# Altium schematic sheet 0002_Page 2.SchDoc
size 553 x 429 mm
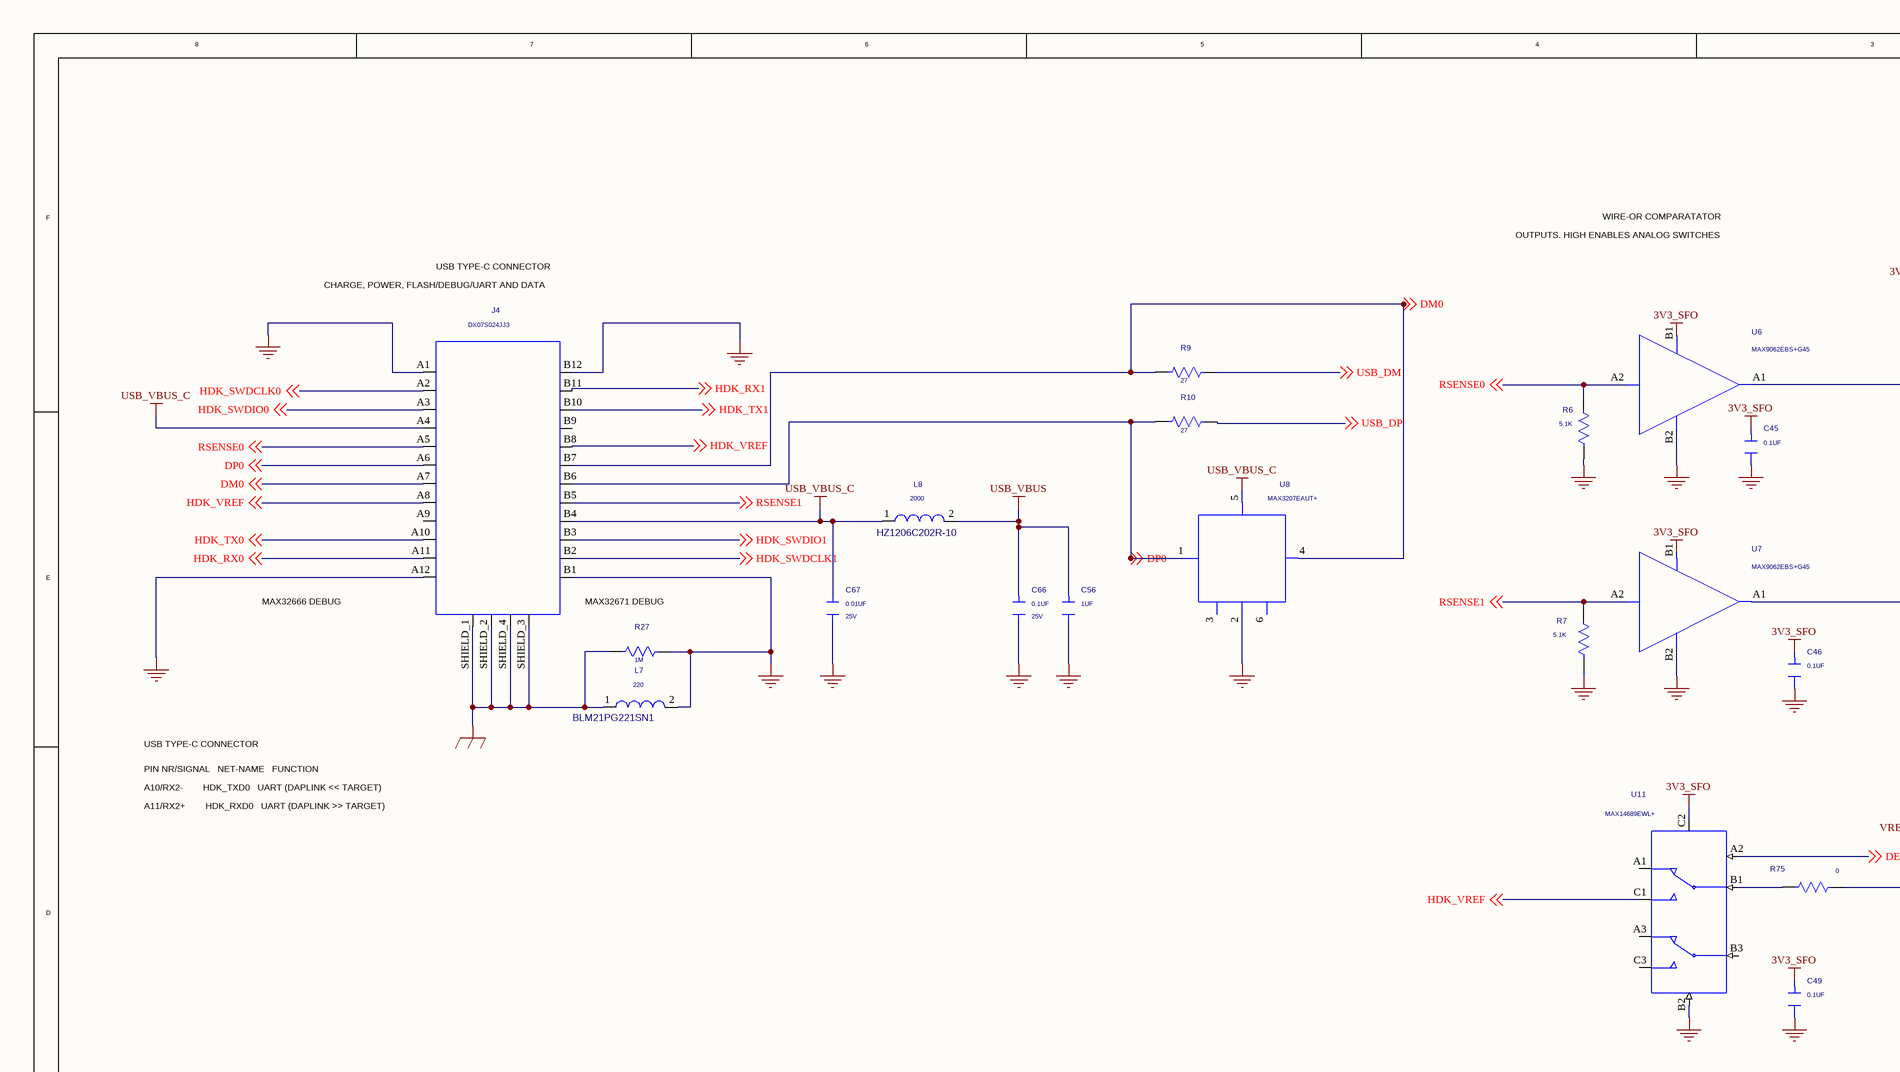
[diagram p0: 0002_Page 2.SchDoc, top left]
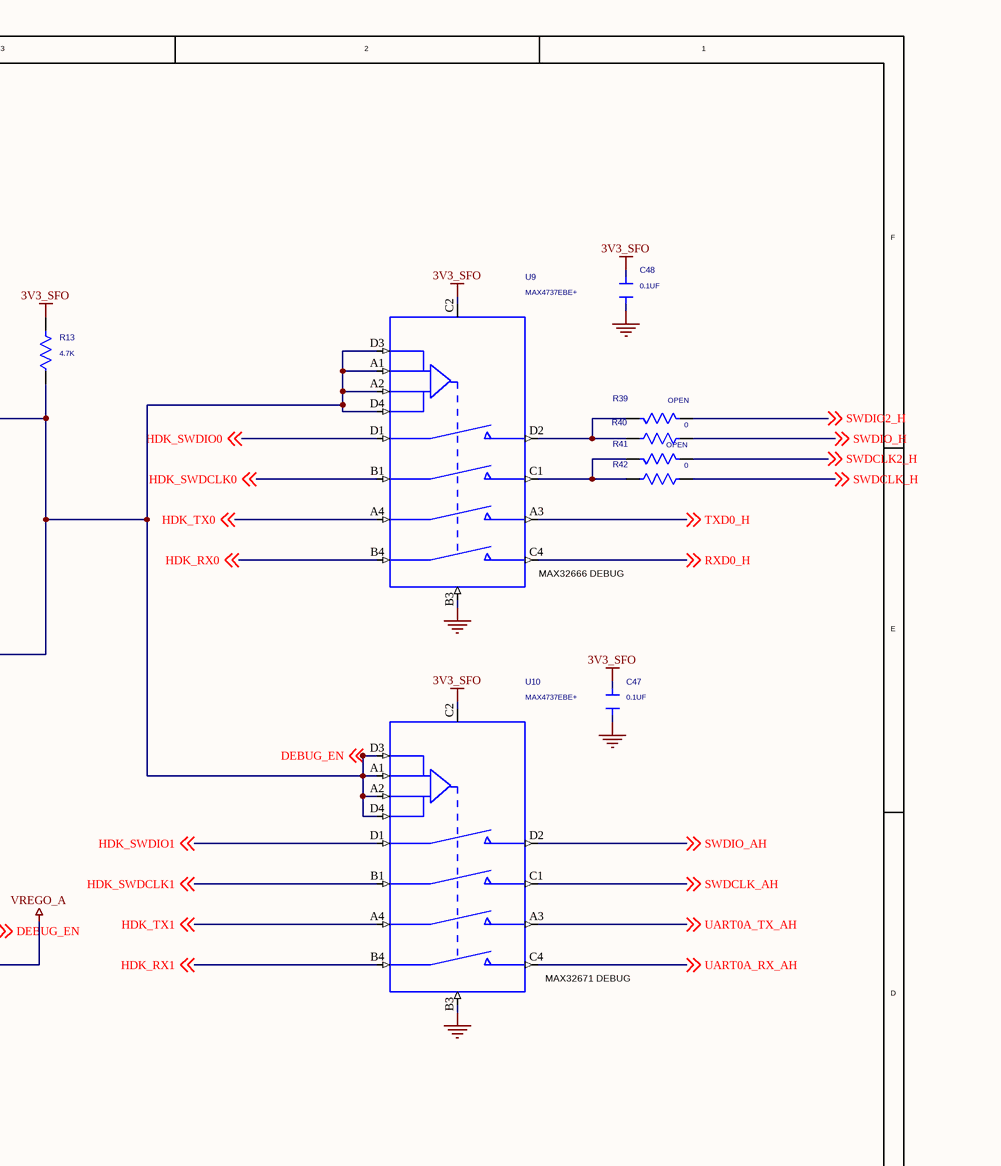
[diagram p1: 0002_Page 2.SchDoc, top middle]
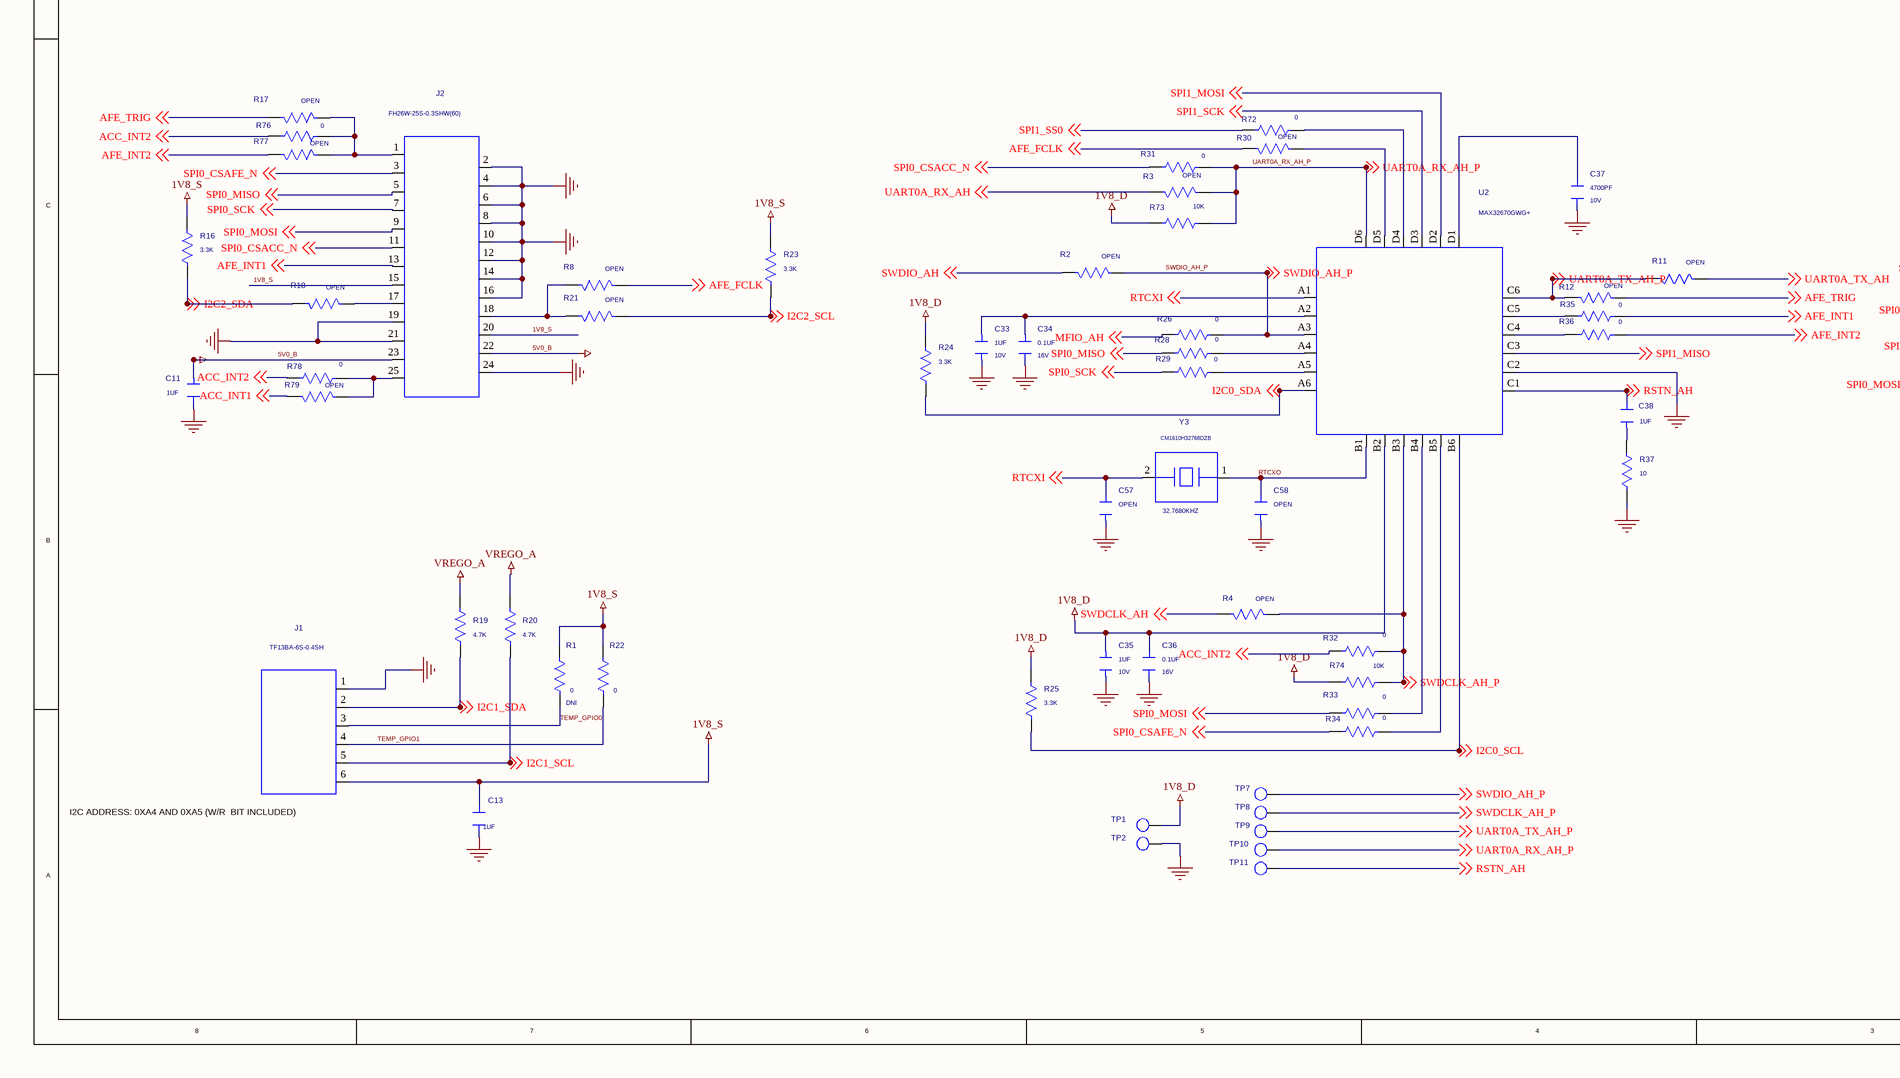
[diagram p2: 0002_Page 2.SchDoc, bottom left]
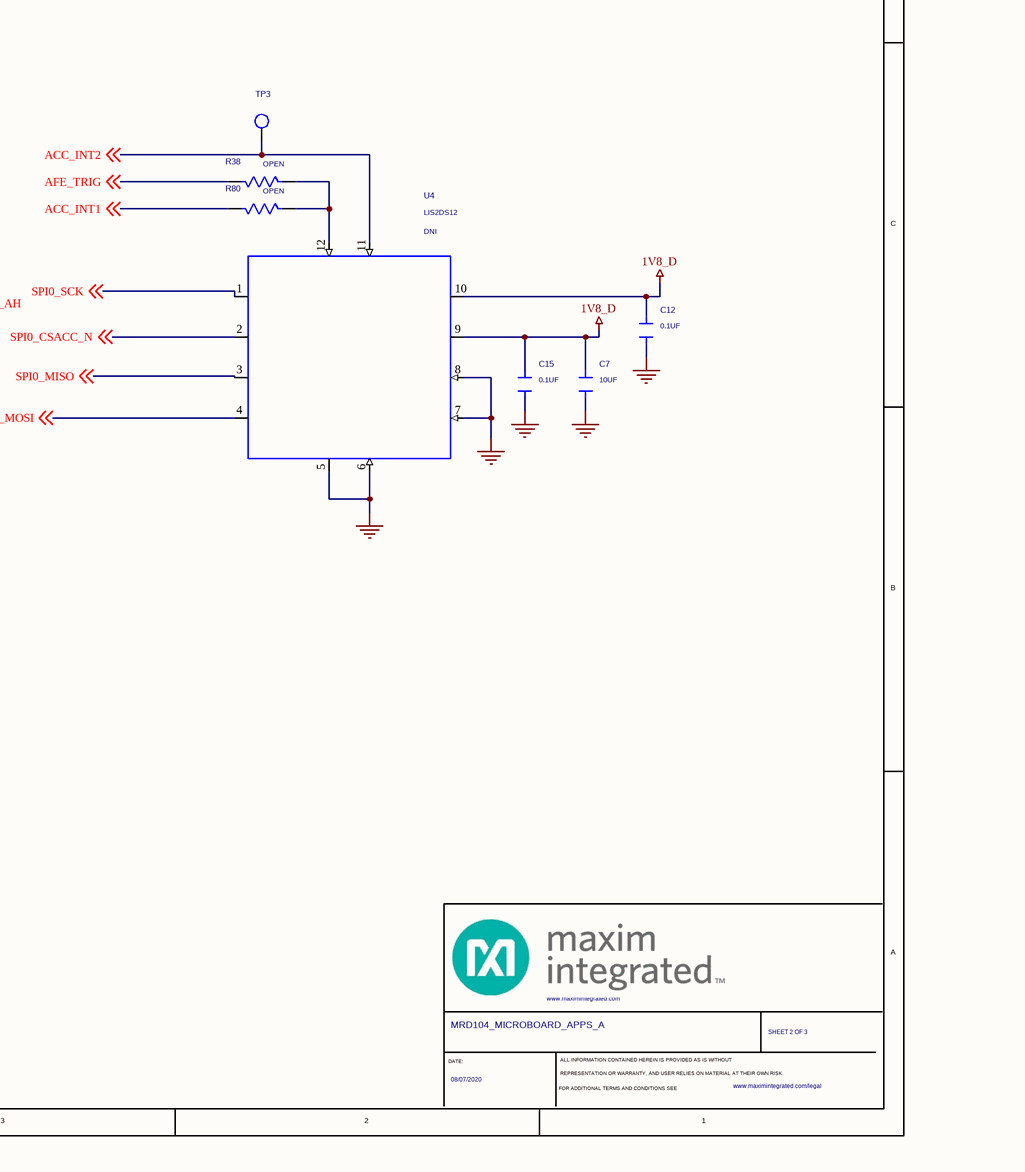
[diagram p3: 0002_Page 2.SchDoc, bottom middle]
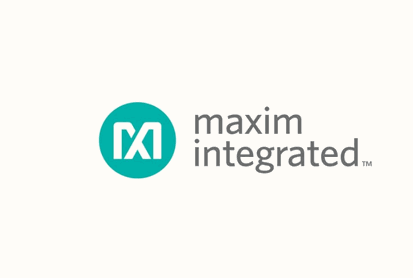
[diagram p4: 0002_Page 2.SchDoc, bottom right]

## Parts
*  CUSTOM_TXT_CDS21: SHEET 2 OF 3  DATE: 08/07/2020  PROJECT_TITLE: MRD104_MICROBOARD_APPS_A  (hidden comment: MAXIM_C_SIZE_CF)  (graphical)
C7  10UF  [0603]
C11  1UF  [CAPC0603X33M]
C12  0.1UF  [CAPC0603X33M]
C13  1UF  [CAPC0603X33M]
C15  0.1UF  [CAPC0603X33M]
C33  1UF  VOLTAGE_RATING: 10V  [CAPC0603X33M]
C34  0.1UF  VOLTAGE_RATING: 16V  [CAPC0603X33M]
C35  1UF  VOLTAGE_RATING: 10V  [CAPC0603X33M]
C36  0.1UF  VOLTAGE_RATING: 16V  [CAPC0603X33M]
C37  4700PF  VOLTAGE_RATING: 10V  [CAPC0603X33M]
C38  1UF  [CAPC0603X33M]
C45  0.1UF  [CAPC0603X33M]
C46  0.1UF  [CAPC0603X33M]
C47  0.1UF  [CAPC0603X33M]
C48  0.1UF  [CAPC0603X33M]
C49  0.1UF  [CAPC0603X33M]
C56  1UF  [0402]
C57  OPEN  [CAPC0603X23L]
C58  OPEN  [CAPC0603X23L]
C66  0.1UF  VOLTAGE_RATING: 25V  [CAPC0603X33M]
C67  0.01UF  VOLTAGE_RATING: 25V  [0402]
J1  TF13BA-6S-0.4SH  [HRSC_TF13BA-6S-0_4SH]
J2  FH26W-25S-0.3SHW(60)  [HRSC_FH26W-25S-0_3SHW]
J4  DX07S024JJ3  [JAE_DX07S024JJ3]
L7  220  MFG_PART_NUMBER: BLM21PG221SN1  [0805]
L8  2000  MFG_PART_NUMBER: HZ1206C202R-10  [1206]
R1  0  VARIANT: DNI  [RESC0603X33M]
R2  OPEN  [RESC0603X23L]
R3  OPEN  [RESC0603X23L]
R4  OPEN  [RESC0603X23L]
R6  5.1K  [RESC0603X33M]
R7  5.1K  [RESC0603X33M]
R8  OPEN  [RESC0603X23L]
R9  27  [RESC0603X33M]
R10  27  [RESC0603X33M]
R11  OPEN  [RESC0603X23L]
R12  OPEN  [RESC0603X23L]
R13  4.7K  [RESC0603X26M]
R16  3.3K  [RESC0603X33M]
R17  OPEN  [RESC0603X23L]
R18  OPEN  [RESC0603X23L]
R19  4.7K  [RESC0603X26M]
R20  4.7K  [RESC0603X26M]
R21  OPEN  [RESC0603X23L]
R22  0  [RESC0603X33M]
R23  3.3K  [RESC0603X33M]
R24  3.3K  [RESC0603X33M]
R25  3.3K  [RESC0603X33M]
R26  0  [RESC0603X33M]
R27  1M  [0402]
R28  0  [RESC0603X33M]
R29  0  [RESC0603X33M]
R30  OPEN  [RESC0603X23L]
R31  0  [RESC0603X33M]
R32  0  [RESC0603X33M]
R33  0  [RESC0603X33M]
R34  0  [RESC0603X33M]
R35  0  [RESC0603X33M]
R36  0  [RESC0603X33M]
R37  10  [RESC0603X33M]
R38  OPEN  [RESC0603X23L]
R39  OPEN  [RESC0603X23L]
R40  0  [RESC0603X33M]
R41  OPEN  [RESC0603X23L]
R42  0  [RESC0603X33M]
R72  0  [RESC0603X33M]
R73  10K  [RESC0603X33M]
R74  10K  [RESC0603X33M]
R75  0  [RESC0603X33M]
R76  0  [RESC0603X33M]
R77  OPEN  [RESC0603X23L]
R78  0  [RESC0603X33M]
R79  OPEN  [RESC0603X23L]
R80  OPEN  [RESC0603X23L]
TP1  TP14PAD  [TP_CIR_0-3556]  (value not drawn)
TP2  TP14PAD  [TP_CIR_0-3556]  (value not drawn)
TP3  TP14PAD  [TP_CIR_0-3556]  (value not drawn)
TP7  TP14PAD  [TP_CIR_0-3556]  (value not drawn)
TP8  TP14PAD  [TP_CIR_0-3556]  (value not drawn)
TP9  TP14PAD  [TP_CIR_0-3556]  (value not drawn)
TP10  TP14PAD  [TP_CIR_0-3556]  (value not drawn)
TP11  TP14PAD  [TP_CIR_0-3556]  (value not drawn)
U2  MAX32670GWG+  [MAXIM_21-100511]
U4  LIS2DS12  VARIANT: DNI  [STMC_LGA-12]
U6  MAX9062EBS+G45  [MAXIM_21-0789]
U7  MAX9062EBS+G45  [MAXIM_21-0789]
U8  MAX3207EAUT+  [MAXIM_90-0175]
U9  MAX4737EBE+  [MAXIM_21-0101_B16-4]
U10  MAX4737EBE+  [MAXIM_21-0101_B16-4]
U11  MAX14689EWL+  [MAXIM_21-0459_W91B1-7]
Y3  32.7680KHZ  MFG_PART_NUMBER: CM1610H32768DZB  [XTALDFN160X100X50-2M]

## Nets
1V8_D: C7.2 C12.2 C15.2 C35.2 C36.2 R24.2 R25.2 R73.1 R74.1 TP1.1(TP1) U2.B2 U4.9(VDD) U4.10(VDDIO)
1V8_S: C13.2 J1.6 J2.15 J2.20 R1.2 R16.2 R22.2 R23.2
3V3_SFO: C45.2 C46.2 C47.2 C48.2 C49.2 R13.1 U6.B1(VCC) U7.B1(VCC) U9.C2(V+) U10.C2(V+) U11.C2(VCC)
5V0_B: C11.2 J2.22 J2.23
GND_POWER: C7.1 C11.1 C12.1 C13.1 C15.1 C33.1 C34.1 C35.1 C36.1 C37.1 C45.1 C46.1 C47.1 C48.1 C49.1 C56.1 C57.1 C58.1 C66.1 C67.1 J1.1 J2.2 J2.4 J2.6 J2.8 J2.10 J2.12 J2.14 J2.16 J2.19 J2.21 J2.24 J4.A1 J4.A12 J4.B1 J4.B12 L7.2 R6.1 R7.1 R27.2 R37.1 TP2.1(TP1) U2.C2 U4.5(NC) U4.6(GND_1) U4.7(RES) U4.8(GND_2) U6.B2(GND) U7.B2(GND) U8.2(GND) U9.B3(GND) U10.B3(GND) U11.B2(GND)
SHIELD: J4.SHIELD_1 J4.SHIELD_2 J4.SHIELD_3(SHIELD_4) J4.SHIELD_4(SHIELD_3) L7.1 R27.1
USB_VBUS: C56.2 C66.2 L8.2
USB_VBUS_C: C67.2 J4.A4 J4.B4 L8.1 U8.5(VCC)
VREGO_A: R19.2 R20.2 R75.2
ACC_INT1: R79.2 R80.2 ; off-sheet ACC_INT1
ACC_INT2: R32.1 R76.1 R78.1 TP3.1(TP1) U4.11(INT2) ; off-sheet ACC_INT2
AFE_FCLK: R8.1 R30.2 ; off-sheet AFE_FCLK
AFE_INT1: J2.13 R35.2 ; off-sheet AFE_INT1
AFE_INT2: R36.2 R77.2 ; off-sheet AFE_INT2
AFE_TRIG: R12.1 R17.2 R38.2 ; off-sheet AFE_TRIG
DEBUG_EN: R13.2 U6.A1(OUT) U7.A1(OUT) U9.A1(IN2) U9.A2(IN3) U9.D3(IN1) U9.D4(IN4) U10.A1(IN2) U10.A2(IN3) U10.D3(IN1) U10.D4(IN4) U11.A2(CB) ; off-sheet DEBUG_EN
DM0: J4.A7 J4.B7 R9.1 U8.4(I/O_2) ; off-sheet DM0
DP0: J4.A6 J4.B6 R10.1 U8.1(I/O_1) ; off-sheet DP0
HDK_RX0: J4.A11 U9.B4(COM4) ; off-sheet HDK_RX0
HDK_RX1: J4.B11 U10.B4(COM4) ; off-sheet HDK_RX1
HDK_SWDCLK0: J4.A2 U9.B1(COM2) ; off-sheet HDK_SWDCLK0
HDK_SWDCLK1: J4.B2 U10.B1(COM2) ; off-sheet HDK_SWDCLK1
HDK_SWDIO0: J4.A3 U9.D1(COM1) ; off-sheet HDK_SWDIO0
HDK_SWDIO1: J4.B3 U10.D1(COM1) ; off-sheet HDK_SWDIO1
HDK_TX0: J4.A10 U9.A4(COM3) ; off-sheet HDK_TX0
HDK_TX1: J4.B10 U10.A4(COM3) ; off-sheet HDK_TX1
HDK_VREF: J4.A8 J4.B8 U11.C1(NO1) ; off-sheet HDK_VREF
I2C0_SCL: R25.1 U2.B6 ; off-sheet I2C0_SCL
I2C0_SDA: R24.1 U2.A6 ; off-sheet I2C0_SDA
I2C1_SCL: J1.5 R20.1 ; off-sheet I2C1_SCL
I2C1_SDA: J1.2 R19.1 ; off-sheet I2C1_SDA
I2C2_SCL: R21.1 R23.1 ; off-sheet I2C2_SCL
I2C2_SDA: R16.1 R18.2 ; off-sheet I2C2_SDA
MFIO_AH: R26.1 ; off-sheet MFIO_AH
RSENSE0: J4.A5 R6.2 U6.A2(IN) ; off-sheet RSENSE0
RSENSE1: J4.B5 R7.2 U7.A2(IN) ; off-sheet RSENSE1
RSTN_AH: C38.2 TP11.1(TP1) U2.C1 ; off-sheet RSTN_AH
RTCXI: C57.2 U2.A1 Y3.2 ; off-sheet RTCXI
RTCXO: C58.2 U2.B1 Y3.1
RXD0_H: U9.C4(NO4) ; off-sheet RXD0_H
SPI0_CSACC_N: J2.11 R31.1 U4.2(CS) ; off-sheet SPI0_CSACC_N
SPI0_CSAFE_N: J2.3 R34.1 ; off-sheet SPI0_CSAFE_N
SPI0_MISO: J2.5 R28.1 U4.3(SDO/SA0) ; off-sheet SPI0_MISO
SPI0_MOSI: J2.9 R33.1 U4.4(SDA/SDI/SDO) ; off-sheet SPI0_MOSI
SPI0_SCK: J2.7 R29.1 U4.1(SCL/SPC) ; off-sheet SPI0_SCK
SPI1_MISO: U2.C3 ; off-sheet SPI1_MISO
SPI1_MOSI: U2.D2 ; off-sheet SPI1_MOSI
SPI1_SCK: U2.D3 ; off-sheet SPI1_SCK
SPI1_SS0: R72.1 ; off-sheet SPI1_SS0
SWDCLK2_H: R41.1 ; off-sheet SWDCLK2_H
SWDCLK_AH: R4.2 U10.C1(NO2) ; off-sheet SWDCLK_AH
SWDCLK_AH_P: R4.1 R32.2 R74.2 TP8.1(TP1) U2.B3 ; off-sheet SWDCLK_AH_P
SWDCLK_H: R42.2 ; off-sheet SWDCLK_H
SWDIO2_H: R39.1 ; off-sheet SWDIO2_H
SWDIO_AH: R2.2 U10.D2(NO1) ; off-sheet SWDIO_AH
SWDIO_AH_P: R2.1 R26.2 TP7.1(TP1) U2.A3 ; off-sheet SWDIO_AH_P
SWDIO_H: R40.2 ; off-sheet SWDIO_H
TEMP_GPIO0: J1.3 R1.1
TEMP_GPIO1: J1.4 R22.1
TXD0_H: U9.A3(NO3) ; off-sheet TXD0_H
UART0A_RX_AH: R3.2 U10.C4(NO4) ; off-sheet UART0A_RX_AH
UART0A_RX_AH_P: R3.1 R31.2 R73.2 TP10.1(TP1) U2.D6 ; off-sheet UART0A_RX_AH_P
UART0A_TX_AH: R11.1 U10.A3(NO3) ; off-sheet UART0A_TX_AH
UART0A_TX_AH_P: R11.2 R12.2 TP9.1(TP1) U2.C6 ; off-sheet UART0A_TX_AH_P
USB_DM: R9.2 ; off-sheet USB_DM
USB_DP: R10.2 ; off-sheet USB_DP
NetC33_2: C33.2 C34.2 U2.A2
NetC37_2: C37.2 U2.D1
NetC38_1: C38.1 R37.2
NetJ2_1: J2.1 R17.1 R76.2 R77.1
NetJ2_17: J2.17 R18.1
NetJ2_18: J2.18 R8.2 R21.2
NetJ2_25: J2.25 R78.2 R79.1
NetR28_2: R28.2 U2.A4
NetR29_2: R29.2 U2.A5
NetR30_1: R30.1 U2.D5
NetR33_2: R33.2 U2.B4
NetR34_2: R34.2 U2.B5
NetR35_1: R35.1 U2.C5
NetR36_1: R36.1 U2.C4
NetR38_1: R38.1 R80.1 U4.12(INT1)
NetR39_2: R39.2 R40.1 U9.D2(NO1)
NetR41_2: R41.2 R42.1 U9.C1(NO2)
NetR72_2: R72.2 U2.D4
NetR75_1: R75.1 U11.B1(COM1)

Not connected (* = marked no-connect by the designer): J4 A9 B9; U8 3(NC1) 6(NC2); U11 A1(NC1) A3(NC2) B3(COM2) C3(NO2)

## Notes on the sheet
- USB TYPE-C CONNECTOR
- OUTPUTS. HIGH ENABLES ANALOG SWITCHES
- WIRE-OR COMPARATATOR
- CHARGE, POWER, FLASH/DEBUG/UART AND DATA
- (near U9) MAX32666 DEBUG
- MAX32666 DEBUG
- (near J4) MAX32671 DEBUG
- PIN NR/SIGNAL   NET-NAME   FUNCTION
- A11/RX2+        HDK_RXD0   UART (DAPLINK >> TARGET)
- A10/RX2-        HDK_TXD0   UART (DAPLINK << TARGET)
- (near U10) MAX32671 DEBUG
- I2C ADDRESS: 0XA4 AND 0XA5 (W/R  BIT INCLUDED)
- (in symbol MAXIM_C_SIZE_CF) 8; 7; 6; 5; 4; 3; 1; F; E; D; C; B; A; DATE:; ALL INFORMATION CONTAINED HEREIN IS PROVIDED AS IS WITHOUT; REPRESENTATION OR WARRANTY, AND USER RELIES ON MATERIAL AT THEIR OWN RISK.; FOR ADDITIONAL TERMS AND CONDITIONS SEE

## Library data of the parts
* = MAXIM_C_SIZE_CF: OriginalSymbolOrigin: (-9396,8292); COMMENT_BODY: TRUE; Page Number: 2; CURRENT_DESIGN_SHEET: Page 2; WEBLINK1: www.maximintegrated.com; LEAGAL_WEBLINK: www.maximintegrated.com/legal
C7 = CAP_NP: CAP; SMT (0603); 10UF; 20%; 25V; X5R; CERAMIC; MFG_PART_NUMBER: C1608X5R1E106M080AC;CL10A106MA8NRNC;GRM188R61E106MA73;ZRB18AR61E106ME01;GRT188R61E106ME13; MANUFACTURER: TDK;SAMSUNG ELECTRONICS;MURATA;MURATA;MURATA; OriginalSymbolOrigin: (-50,50); PACK_TYPE: 0603CAP; MAXINV: 20-0010U-P7; CAP: 1.00E-05; COMMENTS: USE ONLY GRM188R61E106MA73; DRAWING: @MRD104_MICROBOARD_APPS_A_LIB.MRD104_MICROBOARD_APPS_A(SCH_1):PAGE2; PHYS_PAGE: 2; TEMP_RANGE: -55 DEGC TO +85 DEGC; VLOG_PARAM01: CAP:INTEGER; MATERIAL_TYPE: CERAMIC CHIP; PCB Footprint_CDS: 0603; CASE: SMT (0603); REFLOW: -; TOLERANCE: 20%; VER: 2; VOLTAGE_RATING: 25V
C11 C13 = CAP_NP#1: CAP; SMT (0201); 1UF; 20%; 10V; X5R; CERAMIC; MFG_PART_NUMBER: GRM033R61A105ME15; MANUFACTURER: MURATA; OriginalSymbolOrigin: (-50,50); PACK_TYPE: 0201CAPM; MAXINV: 20-0001U-AA20; CAP: 1.00E-06; DRAWING: @MRD104_MICROBOARD_APPS_A_LIB.MRD104_MICROBOARD_APPS_A(SCH_1):PAGE2; PHYS_PAGE: 2; VER: 1; TEMP_RANGE: -55 DEGC TO +85 DEGC; VLOG_PARAM01: CAP:INTEGER; PCB Footprint_CDS: CAPC0603X33M; REFLOW: -; TOLERANCE: 20%; VOLTAGE_RATING: 10V
C12 C15 C34 C36 = CAP_NP: CAP; SMT (0201); 0.1UF; 10%; 16V; X7S; CERAMIC; MFG_PART_NUMBER: GRM033C71C104KE14; MANUFACTURER: MURATA; OriginalSymbolOrigin: (-50,50); PACK_TYPE: 0201CAPM; MAXINV: 20-000U1-BA99; CAP: 1.00E-07; DRAWING: @MRD104_MICROBOARD_APPS_A_LIB.MRD104_MICROBOARD_APPS_A(SCH_1):PAGE2; PHYS_PAGE: 2; TEMP_RANGE: -55 DEGC TO +125 DEGC; VLOG_PARAM01: CAP:INTEGER; PCB Footprint_CDS: CAPC0603X33M; CASE: SMT (0201); TOLERANCE: 10%; VER: 2
  C12 C15: VOLTAGE_RATING: 16V
C33 C35 C38 = CAP_NP: CAP; SMT (0201); 1UF; 20%; 10V; X6S; CERAMIC; MFG_PART_NUMBER: GRM033C81A105ME05; MANUFACTURER: MURATA; OriginalSymbolOrigin: (-50,50); PACK_TYPE: 0201CAPM; MAXINV: 20-0001U-EA78; CAP: 1.00E-06; DRAWING: @MRD104_MICROBOARD_APPS_A_LIB.MRD104_MICROBOARD_APPS_A(SCH_1):PAGE2; PHYS_PAGE: 2; TEMP_RANGE: -55 DEGC TO +105 DEGC; VLOG_PARAM01: CAP:INTEGER; PCB Footprint_CDS: CAPC0603X33M; CASE: SMT (0201); TOLERANCE: 20%; VER: 2
  C38: VOLTAGE_RATING: 10V
C37 = CAP_NP: CAP; SMT (0201); 4700PF; 10%; 10V; X7R; CERAMIC; MFG_PART_NUMBER: GRM033R71A472KA01D; MANUFACTURER: MURATA; OriginalSymbolOrigin: (-50,50); PACK_TYPE: 0201CAPM; MAXINV: 20-4700P-I6; CAP: 4.70E-09; DRAWING: @MRD104_MICROBOARD_APPS_A_LIB.MRD104_MICROBOARD_APPS_A(SCH_1):PAGE2; PHYS_PAGE: 2; TEMP_RANGE: -55 DEGC TO +125 DEGC; VLOG_PARAM01: CAP:INTEGER; PCB Footprint_CDS: CAPC0603X33M; CASE: SMT (0201); TOLERANCE: 10%; VER: 2
C45-C49 = CAP_NP: CAP; SMT (0201); 0.1UF; 10%; 16V; X5R; CERAMIC; MFG_PART_NUMBER: GRM033R61C104K;C0603X5R1C104K030BC; MANUFACTURER: MURATA;TDK; OriginalSymbolOrigin: (-50,50); PACK_TYPE: 0201CAPM; MAXINV: 20-000U1-A26; CAP: 1.00E-07; DRAWING: @MRD104_MICROBOARD_APPS_A_LIB.MRD104_MICROBOARD_APPS_A(SCH_1):PAGE2; PHYS_PAGE: 2; TEMP_RANGE: -55 DEGC TO +85 DEGC; VLOG_PARAM01: CAP:INTEGER; PCB Footprint_CDS: CAPC0603X33M; CASE: SMT (0201); TOLERANCE: 10%; VER: 2; VOLTAGE_RATING: 16V
C56 = CAP_NP: CAP; SMT (0402); 1UF; 10%; 35V; X5R;  CERAMIC; MFG_PART_NUMBER: C1005X5R1V105K050BC; MANUFACTURER: TDK; OriginalSymbolOrigin: (-50,50); PACK_TYPE: 0402CAP; MAXINV: 20-0001U-BA62; CAP: 1.00E-06; DRAWING: @MRD104_MICROBOARD_APPS_A_LIB.MRD104_MICROBOARD_APPS_A(SCH_1):PAGE2; PHYS_PAGE: 2; TEMP_RANGE: -55 DEGC TO +85 DEGC; VLOG_PARAM01: CAP:INTEGER; MATERIAL_TYPE: CERAMIC CHIP; PCB Footprint_CDS: 0402; CASE: SMT; REFLOW: -; TOLERANCE: 10%; VER: 2; VOLTAGE_RATING: 35V
C57 C58 = EK_CAP_NP: CAPACITOR; SMT (0201); OPEN; FORMFACTOR; OriginalSymbolOrigin: (-50,50); PACK_TYPE: 0201_FF; DRAWING: @MRD104_MICROBOARD_APPS_A_LIB.MRD104_MICROBOARD_APPS_A(SCH_1):PAGE2; PHYS_PAGE: 2; VER: 1; MAXINV: N/A; PCB Footprint_CDS: CAPC0603X23L; CAP: N/A; CASE: N/A; MFG_PART_NUMBER: N/A; REFLOW: -; TOLERANCE: N/A; VOLTAGE_RATING: N/A; MANUFACTURER: N/A; TEMP_RANGE: N/A; MATERIAL_TYPE: N/A; VLOG_PARAM01: N/A
C66 = CAP_NP: CAP; SMT (0201); 0.1UF; 20%; 25V; X5R; CERAMIC; MFG_PART_NUMBER: C0603X5R1E104M030BB;GRM033R61E104ME14; MANUFACTURER: TDK;MURATA; OriginalSymbolOrigin: (-50,50); PACK_TYPE: 0201CAPM; MAXINV: 20-000U1-A20A; CAP: 1.00E-07; DRAWING: @MRD104_MICROBOARD_APPS_A_LIB.MRD104_MICROBOARD_APPS_A(SCH_1):PAGE2; PHYS_PAGE: 2; TEMP_RANGE: -55 DEGC TO +85 DEGC; VLOG_PARAM01: CAP:INTEGER; PCB Footprint_CDS: CAPC0603X33M; CASE: SMT (0201); TOLERANCE: 20%; VER: 2
C67 = CAP_NP: CAP; SMT (0402); 0.01UF; 10%; 25V; X5R; CERAMIC; MFG_PART_NUMBER: 04023D103KAT2A; MANUFACTURER: AVX; OriginalSymbolOrigin: (-50,50); PACK_TYPE: 0402CAP; MAXINV: 20-00U01-Z51; CAP: 1.00E-08; DRAWING: @MRD104_MICROBOARD_APPS_A_LIB.MRD104_MICROBOARD_APPS_A(SCH_1):PAGE2; PHYS_PAGE: 2; TEMP_RANGE: -55 DEGC TO +85 DEGC; VLOG_PARAM01: CAP:INTEGER; PCB Footprint_CDS: 0402; CASE: SMT (0402); TOLERANCE: 10%; VER: 2
J1 = TF13BA-6S: CONNECTOR; FEMALE; SMT; TF13BA SERIES; FPC/FFC CONNECTOR; 6PINS; MANUFACTURER: HIROSE ELECTRIC CO LTD; OriginalSymbolOrigin: (-150,275); PACK_TYPE: SMD; MAXINV: EH111000005235; DRAWING: @MRD104_MICROBOARD_APPS_A_LIB.MRD104_MICROBOARD_APPS_A(SCH_1):PAGE2; PHYS_PAGE: 2; VER: 1; VOLTAGE_RATING: +50V; TEMP_RANGE: -55 DEGC TO +85 DEGC; PCB Footprint_CDS: HRSC_TF13BA-6S-0_4SH; MFG_PART_NUMBER: TF13BA-6S-0.4SH; REFLOW: -; SEC_TYPE: SMD; TOLERANCE: N/A
J2 = FH26-25S: CONNECTOR; FEMALE; SMT; FPC CONNECTOR; RIGHT ANGLE; 25PINS; MANUFACTURER: HIROSE ELECTRIC CO. LTD.; OriginalSymbolOrigin: (-150,550); PACK_TYPE: RA; MAXINV: EH111000005014; DRAWING: @MRD104_MICROBOARD_APPS_A_LIB.MRD104_MICROBOARD_APPS_A(SCH_1):PAGE2; PHYS_PAGE: 2; VER: 1; VOLTAGE_RATING: +30V; TEMP_RANGE: -55 DEGC TO +85 DEGC; PCB Footprint_CDS: HRSC_FH26W-25S-0_3SHW; MFG_PART_NUMBER: FH26W-25S-0.3SHW(60); REFLOW: -; SEC_TYPE: RA; TOLERANCE: N/A
J4 = DX07S024JJ3: CONNECTOR; FEMALE; SMT; USB TYPE-C CONNECTOR; DX07 SERIES RECEPTACLE; RIGHT ANGLE; 24PINS; MFG_PART_NUMBER: DX07S024JJ3R1300; MANUFACTURER: JAE ELECTRONIC INDUSTRY; OriginalSymbolOrigin: (-250,550); PACK_TYPE: RA; MAXINV: 01-DX07S024JJ324P-26; DRAWING: @MRD104_MICROBOARD_APPS_A_LIB.MRD104_MICROBOARD_APPS_A(SCH_1):PAGE2; PHYS_PAGE: 2; VER: 1; VOLTAGE_RATING: 20V; TEMP_RANGE: -30 DEGC TO +80 DEGC; PCB Footprint_CDS: JAE_DX07S024JJ3; TOLERANCE: N/A
L7 = FERRITEBEAD: INDUCTOR; SMT (0805); FERRITE-BEAD; 220; TOL=+/-25%; 0.2A; MANUFACTURER: MURATA; OriginalSymbolOrigin: (-100,25); MAXINV: 50-00220-SM2; DRAWING: @MRD104_MICROBOARD_APPS_A_LIB.MRD104_MICROBOARD_APPS_A(SCH_1):PAGE2; PHYS_PAGE: 2; TOLERANCE: 25%; VER: 1; TEMP_RANGE: -55 DEGC TO +125 DEGC; PACK_TYPE: 0805; PCB Footprint_CDS: 0805
L8 = FERRITEBEAD: INDUCTOR; SMT (1206); FERRITE-BEAD; 2000; TOL=+/-25%; 0.3A; MANUFACTURER: LAIRD TECHNOLOGIES; OriginalSymbolOrigin: (-100,25); MAXINV: 51-02000-0AJ; DRAWING: @MRD104_MICROBOARD_APPS_A_LIB.MRD104_MICROBOARD_APPS_A(SCH_1):PAGE2; PHYS_PAGE: 2; TOLERANCE: 25%; VER: 1; PACK_TYPE: 1206; PCB Footprint_CDS: 1206; TEMP_RANGE: N/A
R1 R22 R26 R28 R29 R31-R36 R40 R42 R72 R75 R76 R78 = RES_SMD: RES; SMT (0201); 0; 1%; JUMPER; 0.0500W; MANUFACTURER: VISHAY DALE;PANASONIC; OriginalSymbolOrigin: (-75,50); PACK_TYPE: 0201RES; MAXINV: 80-0000R-95; DRAWING: @MRD104_MICROBOARD_APPS_A_LIB.MRD104_MICROBOARD_APPS_A(SCH_1):PAGE2; PHYS_PAGE: 2; POWER_RATING: 0.05W; RES: 0.00000001E00; TEMP_RANGE: -55 DEGC TO +155 DEGC; VLOG_PARAM01: RES:INTEGER; PCB Footprint_CDS: RESC0603X33M; TOLERANCE: 1%; VER: 2
R2-R4 R8 R11 R12 R17 R18 R21 R30 R38 R39 R41 R77 R79 R80 = EK_RES_SMD: RESISTOR; 0201; OPEN; FORMFACTOR; OriginalSymbolOrigin: (-75,50); PACK_TYPE: 0201_FF; DRAWING: @MRD104_MICROBOARD_APPS_A_LIB.MRD104_MICROBOARD_APPS_A(SCH_1):PAGE2; PHYS_PAGE: 2; MAXINV: N/A; PCB Footprint_CDS: RESC0603X23L; CASE: SMT (0201); MFG_PART_NUMBER: N/A; POWER_RATING: N/A; RES: N/A; TOLERANCE: N/A; VER: 2; MANUFACTURER: N/A; TEMP_RANGE: N/A; VLOG_PARAM01: N/A
R6 R7 = RES_SMD: RES; SMT (0201); 5.1K; 1%; +/-200PPM/DEGC; 0.0500W; MFG_PART_NUMBER: ERJ-1GNF5101C; MANUFACTURER: PANASONIC; OriginalSymbolOrigin: (-75,50); PACK_TYPE: 0201RES; MAXINV: 80-005K1-P0; DRAWING: @MRD104_MICROBOARD_APPS_A_LIB.MRD104_MICROBOARD_APPS_A(SCH_1):PAGE2; PHYS_PAGE: 2; POWER_RATING: 0.05W; RES: 5.10E03; TEMP_RANGE: -55 DEGC TO +125 DEGC; VLOG_PARAM01: RES:INTEGER; MATERIAL_TYPE: THICK FILM; PCB Footprint_CDS: RESC0603X33M; CASE: SMT (0201); REFLOW: -; TOLERANCE: 1%; VER: 2
R9 R10 = RES_SMD: RES; SMT (0201); 27; 1%; +/-100PPM/DEGC; 0.0500W; MFG_PART_NUMBER: ERJ-1GEF27R0C; MANUFACTURER: PANASONIC; OriginalSymbolOrigin: (-75,50); PACK_TYPE: 0201RES; MAXINV: 80-0027R-95; DRAWING: @MRD104_MICROBOARD_APPS_A_LIB.MRD104_MICROBOARD_APPS_A(SCH_1):PAGE2; PHYS_PAGE: 2; POWER_RATING: 0.05W; RES: 2.70E01; TEMP_RANGE: -55 DEGC TO +155 DEGC; VLOG_PARAM01: RES:INTEGER; PCB Footprint_CDS: RESC0603X33M; CASE: SMT (0201); TOLERANCE: 1%; VER: 2
R13 = RES_SMD#1: RES; SMT (0201); 4.7K; 1%; +/-200PPM/DEGC; 0.0500W; MFG_PART_NUMBER: ERJ-1GNF4701; MANUFACTURER: PANASONIC; OriginalSymbolOrigin: (-50,75); PACK_TYPE: 0201RES; MAXINV: ER111000003379; DRAWING: @MRD104_MICROBOARD_APPS_A_LIB.MRD104_MICROBOARD_APPS_A(SCH_1):PAGE2; PHYS_PAGE: 2; POWER_RATING: 0.05W; RES: 4.70E03; VER: 4; TEMP_RANGE: -55 DEGC TO +125 DEGC; VLOG_PARAM01: RES:INTEGER; MATERIAL_TYPE: THICK FILM; PCB Footprint_CDS: RESC0603X26M; CASE: SMT (0201); REFLOW: -; TOLERANCE: 1%
R16 R23-R25 = RES_SMD: RES; SMT (0201); 3.3K; 1%; +/-100PPM/DEGC; 0.0500W; MFG_PART_NUMBER: ERJ-1GEF3301C; MANUFACTURER: PANASONIC; OriginalSymbolOrigin: (-75,50); PACK_TYPE: 0201RES; MAXINV: 80-003K3-95; DRAWING: @MRD104_MICROBOARD_APPS_A_LIB.MRD104_MICROBOARD_APPS_A(SCH_1):PAGE2; PHYS_PAGE: 2; POWER_RATING: 0.05W; RES: 3.30E03; TEMP_RANGE: -55 DEGC TO +155 DEGC; VLOG_PARAM01: RES:INTEGER; PCB Footprint_CDS: RESC0603X33M; CASE: SMT (0201); TOLERANCE: 1%; VER: 2
R19 = RES_SMD: RES; SMT (0201); 4.7K; 1%; +/-200PPM/DEGC; 0.0500W; MFG_PART_NUMBER: ERJ-1GNF4701; MANUFACTURER: PANASONIC; OriginalSymbolOrigin: (-75,50); PACK_TYPE: 0201RES; MAXINV: ER111000003379; DRAWING: @MRD104_MICROBOARD_APPS_A_LIB.MRD104_MICROBOARD_APPS_A(SCH_1):PAGE2; PHYS_PAGE: 2; POWER_RATING: 0.05W; RES: 4.70E03; TEMP_RANGE: -55 DEGC TO +125 DEGC; VLOG_PARAM01: RES:INTEGER; MATERIAL_TYPE: THICK FILM; PCB Footprint_CDS: RESC0603X26M; CASE: SMT (0201); REFLOW: -; TOLERANCE: 1%; VER: 2
R20 = RES_SMD: RES; SMT (0201); 4.7K; 1%; +/-200PPM/DEGC; 0.0500W; MFG_PART_NUMBER: ERJ-1GNF4701; MANUFACTURER: PANASONIC; OriginalSymbolOrigin: (-75,50); PACK_TYPE: 0201RES; MAXINV: ER111000003379; DRAWING: @MRD104_MICROBOARD_APPS_A_LIB.MRD104_MICROBOARD_APPS_A(SCH_1):PAGE2; PHYS_PAGE: 2; POWER_RATING: 0.05W; RES: 4.70E03; TEMP_RANGE: -55 DEGC TO +125 DEGC; MATERIAL_TYPE: THICK FILM; VLOG_PARAM01: RES:INTEGER; PCB Footprint_CDS: RESC0603X26M; CASE: SMT (0201); REFLOW: -; TOLERANCE: 1%; VER: 2
R27 = RES_SMD: RES; SMT (0402); 1M; 1%; +/-100PPM/DEGC; 0.1000W; MFG_PART_NUMBER: ERJ-2RKF1004; MANUFACTURER: PANASONIC; OriginalSymbolOrigin: (-75,50); PACK_TYPE: 0402RES; MAXINV: 80-0001M-18; DRAWING: @MRD104_MICROBOARD_APPS_A_LIB.MRD104_MICROBOARD_APPS_A(SCH_1):PAGE2; PHYS_PAGE: 2; POWER_RATING: 0.10W; RES: 1.00E06; TEMP_RANGE: -55 DEGC TO +155 DEGC; VLOG_PARAM01: RES:INTEGER; PCB Footprint_CDS: 0402; CASE: SMT (0402); TOLERANCE: 1%; VER: 2
R37 = RES_SMD: RES; SMT (0201); 10; 1%; +/-100PPM/DEGC; 0.0500W; MFG_PART_NUMBER: ERJ-1GEF10R0; MANUFACTURER: PANASONIC; OriginalSymbolOrigin: (-75,50); PACK_TYPE: 0201RES; MAXINV: 80-0010R-95; DRAWING: @MRD104_MICROBOARD_APPS_A_LIB.MRD104_MICROBOARD_APPS_A(SCH_1):PAGE2; PHYS_PAGE: 2; POWER_RATING: 0.05W; RES: 1.00E01; TEMP_RANGE: -55 DEGC TO +155 DEGC; VLOG_PARAM01: RES:INTEGER; PCB Footprint_CDS: RESC0603X33M; CASE: SMT (0201); TOLERANCE: 1%; VER: 2
R73 R74 = RES_SMD: RES; SMT (0201); 10K; 5%; +/-200PPM/DEGC; 0.0500W; MFG_PART_NUMBER: ERJ-1GNJ103; MANUFACTURER: PANASONIC; OriginalSymbolOrigin: (-75,50); PACK_TYPE: 0201RES; MAXINV: 80-0010K-AA89; DRAWING: @MRD104_MICROBOARD_APPS_A_LIB.MRD104_MICROBOARD_APPS_A(SCH_1):PAGE2; PHYS_PAGE: 2; POWER_RATING: 0.05W; RES: 1.00E04; TEMP_RANGE: -55 DEGC TO +125 DEGC; VLOG_PARAM01: RES:INTEGER; MATERIAL_TYPE: THICK FILM; PCB Footprint_CDS: RESC0603X33M; CASE: SMT (0201); REFLOW: -; TOLERANCE: 5%; VER: 2
TP1-TP3 TP7-TP11 = EVKIT_TP: TEST POINT; PAD DIA=0.014IN (0.3556MM); OriginalSymbolOrigin: (-125,50); DRAWING: @MRD104_MICROBOARD_APPS_A_LIB.MRD104_MICROBOARD_APPS_A(SCH_1):PAGE2; PHYS_PAGE: 2; VER: 1; PACK_TYPE: EVKIT_TP; MAXINV: N/A; PCB Footprint_CDS: TP_CIR_0-3556; MFG_PART_NUMBER: N/A; TOLERANCE: N/A; VOLTAGE_RATING: N/A; TEMP_RANGE: N/A
U2 = EK_MAX32670: EVKIT PART - IC; MAX32670GWG+; PACKAGE OUTLINE DRAWING: 21-100151; PACKAGE CODE: W241H2+1; WLP24; MANUFACTURER: MAXIM; OriginalSymbolOrigin: (-375,375); COMMENTS: THIS PART NUMBER WILL BE CUSTOMIZED FOR HSP/MRD104 AND UPDATED, CONFIRM THE PART NUMBER BEFORE ORDER; DRAWING: @MRD104_MICROBOARD_APPS_A_LIB.MRD104_MICROBOARD_APPS_A(SCH_1):PAGE2; PHYS_PAGE: 2; VER: 1; PACK_TYPE: WLP24; MAXINV: N/A; PCB Footprint_CDS: MAXIM_21-100511; MFG_PART_NUMBER: MAX32670GWG+; REFLOW: -; SEC_TYPE: WLP24; TOLERANCE: N/A; VOLTAGE_RATING: N/A; TEMP_RANGE: N/A
U4 = LIS2DS12: IC; MEMS; DIGITAL OUTPUT MOTION SENSOR; ULTRA-LOW-POWER HIGH-PERFORMANCE 3-AXIS PICO ACCELEROMETER; MICROELECTROMECHANICAL SYSTEMS; LGA12; NOTE: MANUFACTURER; MANUFACTURER: ST MICROELECTRONICS; OriginalSymbolOrigin: (-375,375); MAXINV: EQ111000005315; DRAWING: @MRD104_MICROBOARD_APPS_A_LIB.MRD104_MICROBOARD_APPS_A(SCH_1):PAGE2; PHYS_PAGE: 2; VER: 1; VOLTAGE_RATING: +1.62V TO +1.98V; TEMP_RANGE: -40 DEGC TO +85 DEGC; PACK_TYPE: LGA12; PCB Footprint_CDS: STMC_LGA-12; CASE: LGA12; CLASSIFICATION: MICROELECTROMECHANICAL SYSTEMS; MFG_PART_NUMBER: LIS2DS12; REFLOW: -; TOLERANCE: N/A
U6 U7 = MAX9062: IC; COMP; ULTRA-SMALL; LOW-POWER SINGLE COMPARATOR; UCSP4; MANUFACTURER: MAXIM; OriginalSymbolOrigin: (-250,225); MAXINV: 10-MAX9062EBSG45-B; DRAWING: @MRD104_MICROBOARD_APPS_A_LIB.MRD104_MICROBOARD_APPS_A(SCH_1):PAGE2; PHYS_PAGE: 2; VER: 1; VOLTAGE_RATING: -0.3V TO +5.5V; TEMP_RANGE: -40 DEGC TO +85 DEGC; PACK_TYPE: UCSP4; PCB Footprint_CDS: MAXIM_21-0789; CASE: UCSP4; MFG_PART_NUMBER: MAX9062EBS+G45; TOLERANCE: N/A
U8 = MAX3207: IC; PROT; DUAL, QUAD, AND HEX HIGH-SPEED DIFFERENTIAL ESD-PROTECTION IC; SOT23-6; MANUFACTURER: MAXIM; OriginalSymbolOrigin: (-250,225); MAXINV: 10-MAX3207EAUT-U; CLASSIFICATION: PROTECTION/PROTECTOR; DRAWING: @MRD104_MICROBOARD_APPS_A_LIB.MRD104_MICROBOARD_APPS_A(SCH_1):PAGE2; PHYS_PAGE: 2; VER: 1; VOLTAGE_RATING: +0.9V TO +5.5V; TEMP_RANGE: -40 DEGC TO +125 DEGC; PACK_TYPE: SOT23-6; PCB Footprint_CDS: MAXIM_90-0175; CASE: SOT23-6; MFG_PART_NUMBER: MAX3207EAUT+; REFLOW: -; TOLERANCE: N/A
U9 U10 = MAX4737: IC; ASW; 4.5OHM QUAD SPST ANALOG SWITCH IN UCSP; 2X2; UCSP16; MANUFACTURER: MAXIM; OriginalSymbolOrigin: (-250,500); PACK_TYPE: UCSP16_B16-4; MAXINV: 10-MAX4737EBE-B; DRAWING: @MRD104_MICROBOARD_APPS_A_LIB.MRD104_MICROBOARD_APPS_A(SCH_1):PAGE2; PHYS_PAGE: 2; VER: 1; VOLTAGE_RATING: +1.8V TO +5.5V; TEMP_RANGE: -40 DEGC TO +85 DEGC; PCB Footprint_CDS: MAXIM_21-0101_B16-4; CASE: UCSP16; MFG_PART_NUMBER: MAX4737EBE+; SEC_TYPE: UCSP16_B16-4; TOLERANCE: N/A
U11 = MAX14689: IC; ASW; ULTRA-SMALL LOW-RON BEYOND-THE-RAILS DPDT ANALOG SWITCHES; WLP9; MANUFACTURER: MAXIM; OriginalSymbolOrigin: (-150,325); MAXINV: 10-MAX14689EWL-W; DRAWING: @MRD104_MICROBOARD_APPS_A_LIB.MRD104_MICROBOARD_APPS_A(SCH_1):PAGE2; PHYS_PAGE: 2; VER: 1; VOLTAGE_RATING: +1.6V TO +5.5V; TEMP_RANGE: -40 DEGC TO +85 DEGC; PACK_TYPE: WLP9; PCB Footprint_CDS: MAXIM_21-0459_W91B1-7; CASE: WLP9; MFG_PART_NUMBER: MAX14689EWL+; SEC_TYPE: WLP9; TOLERANCE: N/A
Y3 = XTAL: CRYSTAL; SMT; 32.7680KHZ; 6PF; TOL = +/-20PPM; MANUFACTURER: CITIZEN; OriginalSymbolOrigin: (-125,100); MAXINV: 60-32K76-0ET; DRAWING: @MRD104_MICROBOARD_APPS_A_LIB.MRD104_MICROBOARD_APPS_A(SCH_1):PAGE2; PHYS_PAGE: 2; VER: 11; TEMP_RANGE: -40 DEGC TO +85 DEGC; PACK_TYPE: XTALDFN160X100X50-2M; PCB Footprint_CDS: XTALDFN160X100X50-2M; REFLOW: -; TOLERANCE: +/-20PPM; VOLTAGE_RATING: N/A